# EAGLE schematic Educational-BoosterPack-RevA1-schematic (EAGLE 6.1)
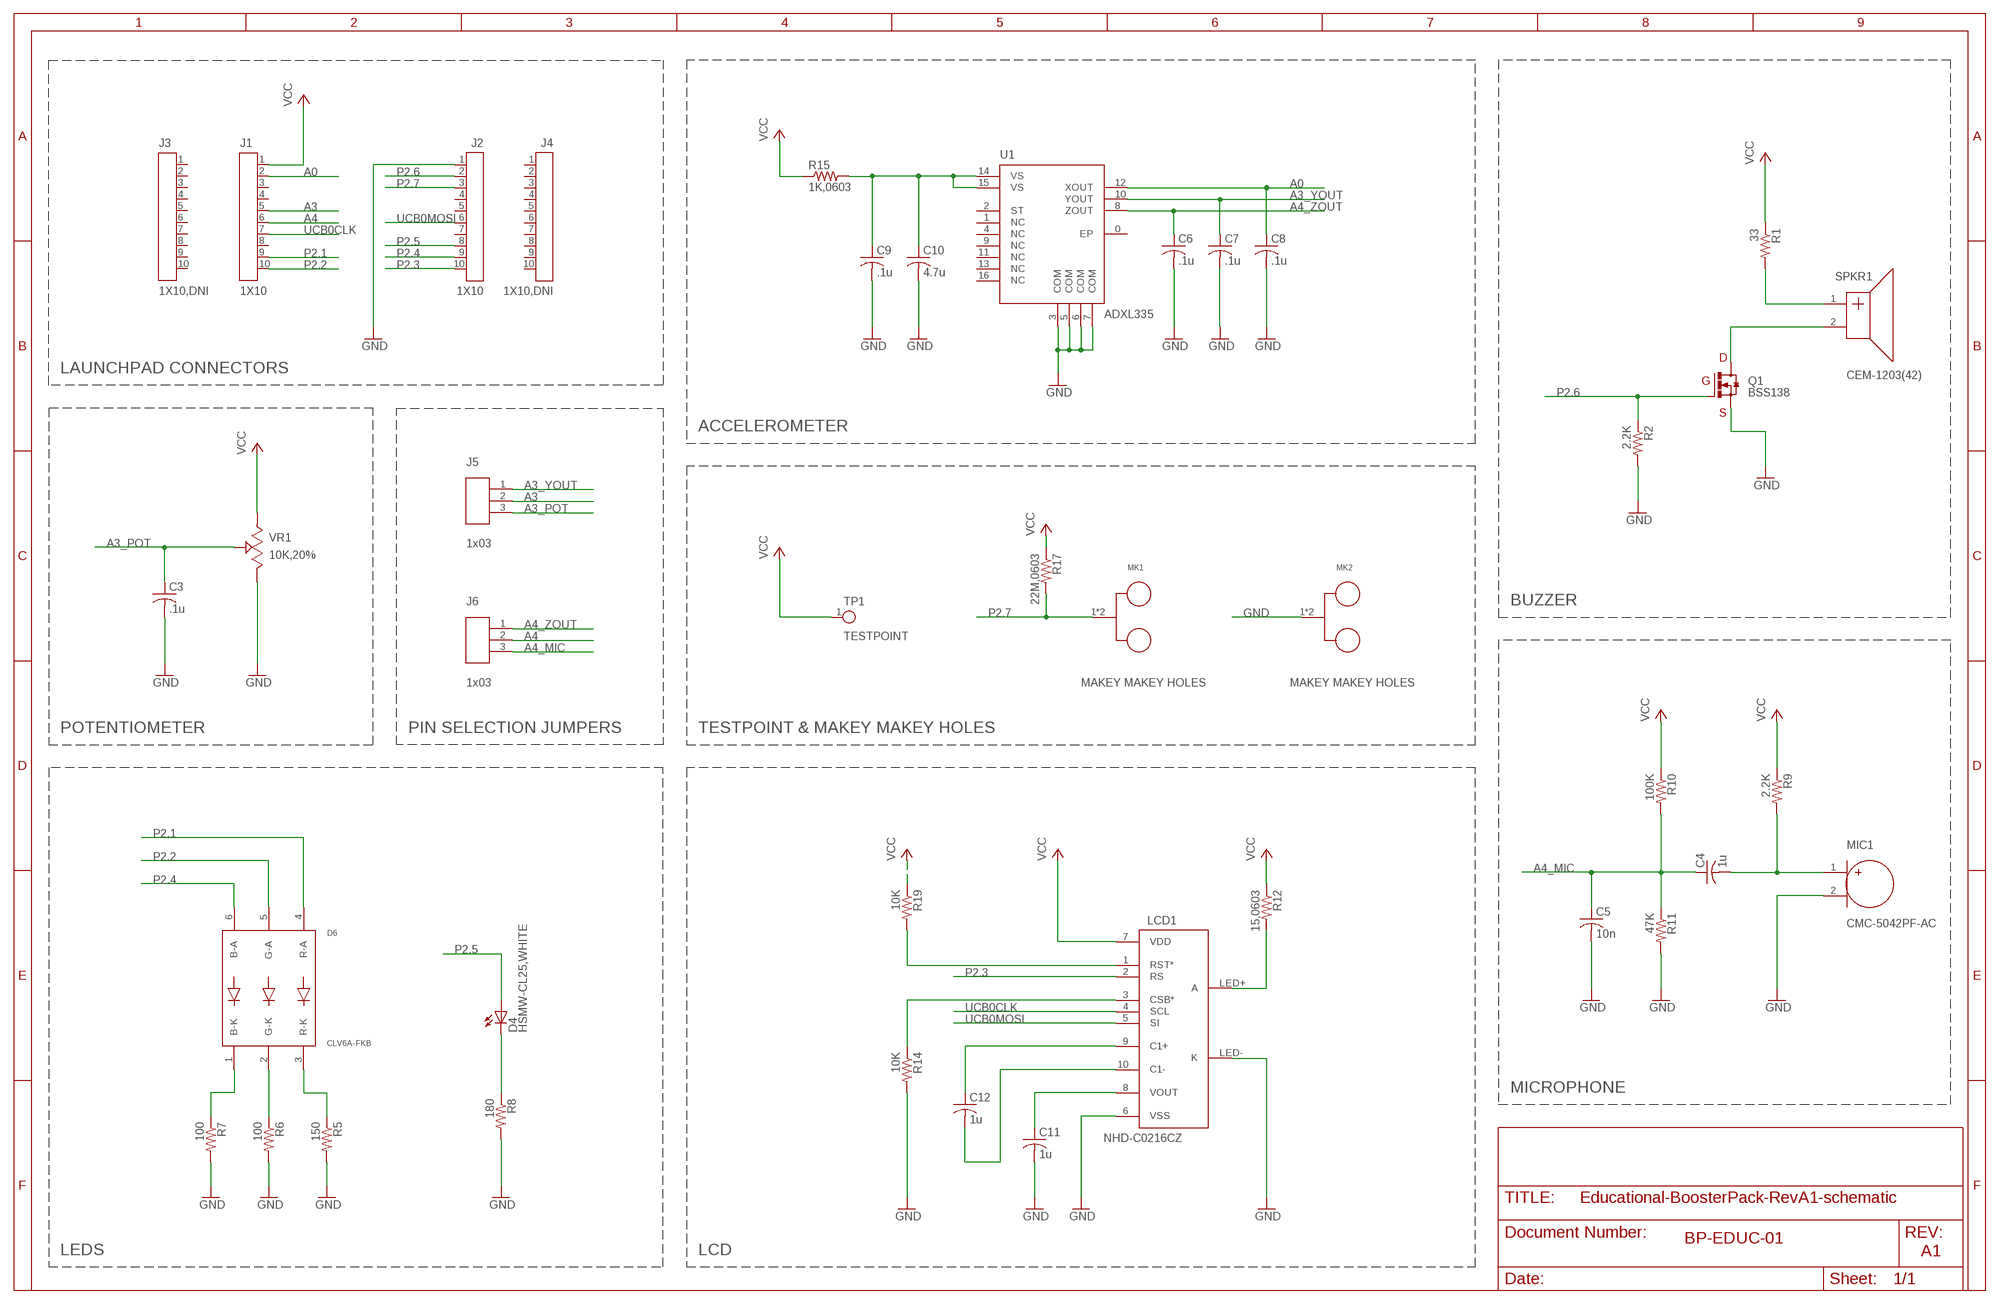
[diagram p0: schematic, sheet 1]

## Parts
C3  .1u  C-USC0402  [C0402]
C4  1u  C-USC0402  [C0402]
C5  10n  C-USC0402  [C0402]
C6  .1u  C-USC0402  [C0402]
C7  .1u  C-USC0402  [C0402]
C8  .1u  C-USC0402  [C0402]
C9  .1u  C-USC0402  [C0402]
C10  4.7u  C-USC0603  [C0603]
C11  1u  C-USC0402  [C0402]
C12  1u  C-USC0402  [C0402]
D4  HSMW-CL25,WHITE  LEDCHIPLED_0603  [CHIPLED_0603]
D6  CLV6A-FKB  [TRICOLOR-LED6]
J1  1X10  HEADER1X10  [1X10]
J2  1X10  HEADER1X10  [1X10]
J3  1X10,DNI  HEADER1X10  [1X10]
J4  1X10,DNI  HEADER1X10  [1X10]
J5  1x03  HEADER1X03  [1X03]
J6  1x03  HEADER1X03  [1X03]
LCD1  NHD-C0216CZ  [GENERIC-LCD10-2]
MIC1  CMC-5042PF-AC  [GENERIC-2PADS2]
MK1  MAKEYMAKEY  [MAKEYMAKEY]
MK2  MAKEYMAKEY  [MAKEYMAKEY]
Q1  BSS138  [SOT23-3]
R1  33  R-US_R0402  [R0402]
R2  2.2K  R-US_R0402  [R0402]
R5  150  R-US_R0402  [R0402]
R6  100  R-US_R0402  [R0402]
R7  100  R-US_R0402  [R0402]
R8  180  R-US_R0402  [R0402]
R9  2.2K  R-US_R0402  [R0402]
R10  100K  R-US_R0402  [R0402]
R11  47K  R-US_R0402  [R0402]
R12  15,0603  R-US_R0603  [R0603]
R14  10K  R-US_R0402  [R0402]
R15  1K,0603  R-US_R0603  [R0603]
R17  22M,0603  R-US_R0603  [R0603]
R19  10K  R-US_R0402  [R0402]
SPKR1  CEM-1203(42)  [GENERIC-2PADS]
TP1  TESTPOINT  [TESTPOINT]
U1  ADXL335  [LFCSP-16]
VR1  10K,20%  3352T  [GENERIC-3HOLES]

## Nets
A0: C8.1 J1.2 U1.12(XOUT)
A3: J1.5 J5.2
A3_POT: C3.1 J5.3 VR1.2
A3_YOUT: C7.1 J5.1 U1.10(YOUT)
A4: J1.6 J6.2
A4_MIC: C4.1 C5.1 J6.3 R10.2 R11.1
A4_ZOUT: C6.1 J6.1 U1.8(ZOUT)
GND: C3.2 C5.2 C6.2 C7.2 C8.2 C9.2 C10.2 C11.2 J2.1 LCD1.6(VSS) LCD1.LED-(K) MIC1.2(MIC_N) MK2.1 MK2.2 Q1.2(S) R2.2 R5.2 R6.2 R7.2 R8.2 R11.2 R14.2 U1.3(COM) U1.5(COM) U1.6(COM) U1.7(COM) VR1.3
N$1: C9.1 C10.1 R15.2 U1.14(VS) U1.15(VS)
N$2: C4.2 MIC1.1(MIC_P) R9.2
N$3: LCD1.LED+(A) R12.2
N$4: D6.2(G-K) R6.1
N$5: R1.2 SPKR1.1(SPKR_P)
N$6: Q1.3(D) SPKR1.2(SPKR_N)
N$7: LCD1.3(CSB*) R14.1
N$8: D6.3(R-K) R5.1
N$9: D6.1(B-K) R7.1
N$10: C11.1 LCD1.8(VOUT)
N$11: C12.2 LCD1.10(C1-)
N$12: C12.1 LCD1.9(C1+)
N$13: LCD1.1(RST*) R19.2
N$16: D4.C R8.1
P2.1: D6.4(R-A) J1.9
P2.2: D6.5(G-A) J1.10
P2.3: J2.10 LCD1.2(RS)
P2.4: D6.6(B-A) J2.9
P2.5: D4.A J2.8
P2.6: J2.2 Q1.1(G) R2.1
P2.7: J2.3 MK1.1 MK1.2 R17.2
UCB0CLK: J1.7 LCD1.4(SCL)
UCB0MOSI: J2.6 LCD1.5(SI)
VCC: J1.1 LCD1.7(VDD) R1.1 R9.1 R10.1 R12.1 R15.1 R17.1 R19.1 TP1.1 VR1.1
Unconnected: J1.3 J1.4 J1.8 J2.4 J2.5 J2.7 J3.1 J3.2 J3.3 J3.4 J3.5 J3.6 J3.7 J3.8 J3.9 J3.10 J4.1 J4.2 J4.3 J4.4 J4.5 J4.6 J4.7 J4.8 J4.9 J4.10 U1.0(EP) U1.1(NC) U1.2(ST) U1.4(NC) U1.9(NC) U1.11(NC) U1.13(NC) U1.16(NC)

## Notes on the sheet
- LAUNCHPAD CONNECTORS
- ACCELEROMETER
- BUZZER
- MAKEY MAKEY HOLES | MAKEY MAKEY HOLES
- POTENTIOMETER | PIN SELECTION JUMPERS | TESTPOINT & MAKEY MAKEY HOLES
- MICROPHONE
- BP-EDUC-01
- LEDS | LCD | A1

## Library data of the parts
C3-C12 = resistor:C-US: CAPACITOR, American symbol
D4 = led:LED: LED OSRAM: - CHIPLED LG R971, LG N971, LY N971, LG Q971, LY Q971, LO R971, LY R971 LH N974, LH R974 LS Q976, LO Q976, LY Q976 LO Q996 - Hyper CHIPLED LW Q18S LB Q993, LB Q99A, LB R99A - SideLED LS A670, LO A670, LY A670, LG A670, LP A670 LB A673, LV A673, LT A673, LW A673 LH A674 LY A675 LS A676, LA A676, LO A676, LY A676, LW A676 LS A679, LY A679, LG A679 - Hyper Micro SIDELED® LS Y876, LA Y876, LO Y876, LY Y876 LT Y87S - SmartLED LW L88C, LW L88S LB L89C, LB L89S, LG L890 LS L89K, LO L89K, LY L89K LS L896, LA L896, LO L896, LY L896 - TOPLED LS T670, LO T670, LY T670, LG T670, LP T670 LSG T670, LSP T670, LSY T670, LOP T670, LYG T670 LG T671, LOG T671, LSG T671 LB T673, LV T673, LT T673, LW T673 LH T674 LS T676, LA T676, LO T676, LY T676, LB T676, LH T676, LSB T676, LW T676 LB T67C, LV T67C, LT T67C, LS T67K, LO T67K, LY T67K, LW E67C LS E67B, LA E67B, LO E67B, LY E67B, LB E67C, LV E67C, LT E67C LW T67C LS T679, LY T679, LG T679 LS T770, LO T770, LY T770, LG T770, LP T770 LB T773, LV T773, LT T773, LW T773 LH T774 LS E675, LA E675, LY E675, LS T675 LS T776, LA T776, LO T776, LY T776, LB T776 LHGB T686 LT T68C, LB T68C - Hyper Mini TOPLED® LB M676 - Mini TOPLED Santana® LG M470 LS M47K, LO M47K, LY M47K Source: http://www.osram.convergy.de LUXEON: - LUMILED® LXK2-PW12-R00, LXK2-PW12-S00, LXK2-PW14-U00, LXK2-PW14-V00 LXK2-PM12-R00, LXK2-PM12-S00, LXK2-PM14-U00 LXK2-PE12-Q00, LXK2-PE12-R00, LXK2-PE12-S00, LXK2-PE14-T00, LXK2-PE14-U00 LXK2-PB12-K00, LXK2-PB12-L00, LXK2-PB12-M00, LXK2-PB14-N00, LXK2-PB14-P00, LXK2-PB14-Q00 LXK2-PR12-L00, LXK2-PR12-M00, LXK2-PR14-Q00, LXK2-PR14-R00 LXK2-PD12-Q00, LXK2-PD12-R00, LXK2-PD12-S00 LXK2-PH12-R00, LXK2-PH12-S00 LXK2-PL12-P00, LXK2-PL12-Q00, LXK2-PL12-R00 Source: www.luxeon.com KINGBRIGHT: KA-3528ASYC Source: www.kingbright.com
D6 = CCo-Boost:CLV6A-FKB
J1-J4 = CCo-Boost:HEADER1X10
J5 J6 = CCo-Boost:HEADER1X03
LCD1 = CCo-Boost:NHD-C0216CZ
MIC1 = CCo-Boost:CMC-5042PF-AC
MK1 MK2 = CCo-Boost:MAKEYMAKEY
Q1 = CCo-Boost:BSS138: BSS138 N-Channel Logic Level Enhancement Mode Field Effect Transistor
R1 R2 R5-R12 R14 R15 R17 R19 = resistor:R-US_: RESISTOR, American symbol
SPKR1 = CCo-Boost:CEM-1203(42)
TP1 = CCo-Boost:TESTPOINT
U1 = CCo-Boost:ADXL335: ADXL335 A small, thin, low power, complete 3-axis accelerometer. The ADXL335 is available in a small, low profile, 4mm x 4mm x 1.45mm, 16-lead, plastic lead frame chip scale package (LFCSP_LQ)
VR1 = CCo-Boost:3352T